# Altium schematic sheet 10_USB_Ethernet.SchDoc: USB Ethernet
size A3; Organization: Lime Microsystems; Address1: Surrey Tech Centre; Address2: Guildford GU2 7YG; Address3: Surrey; Address4: United Kingdom; Revision: v2.0; SheetNumber: 10; SheetTotal: 15
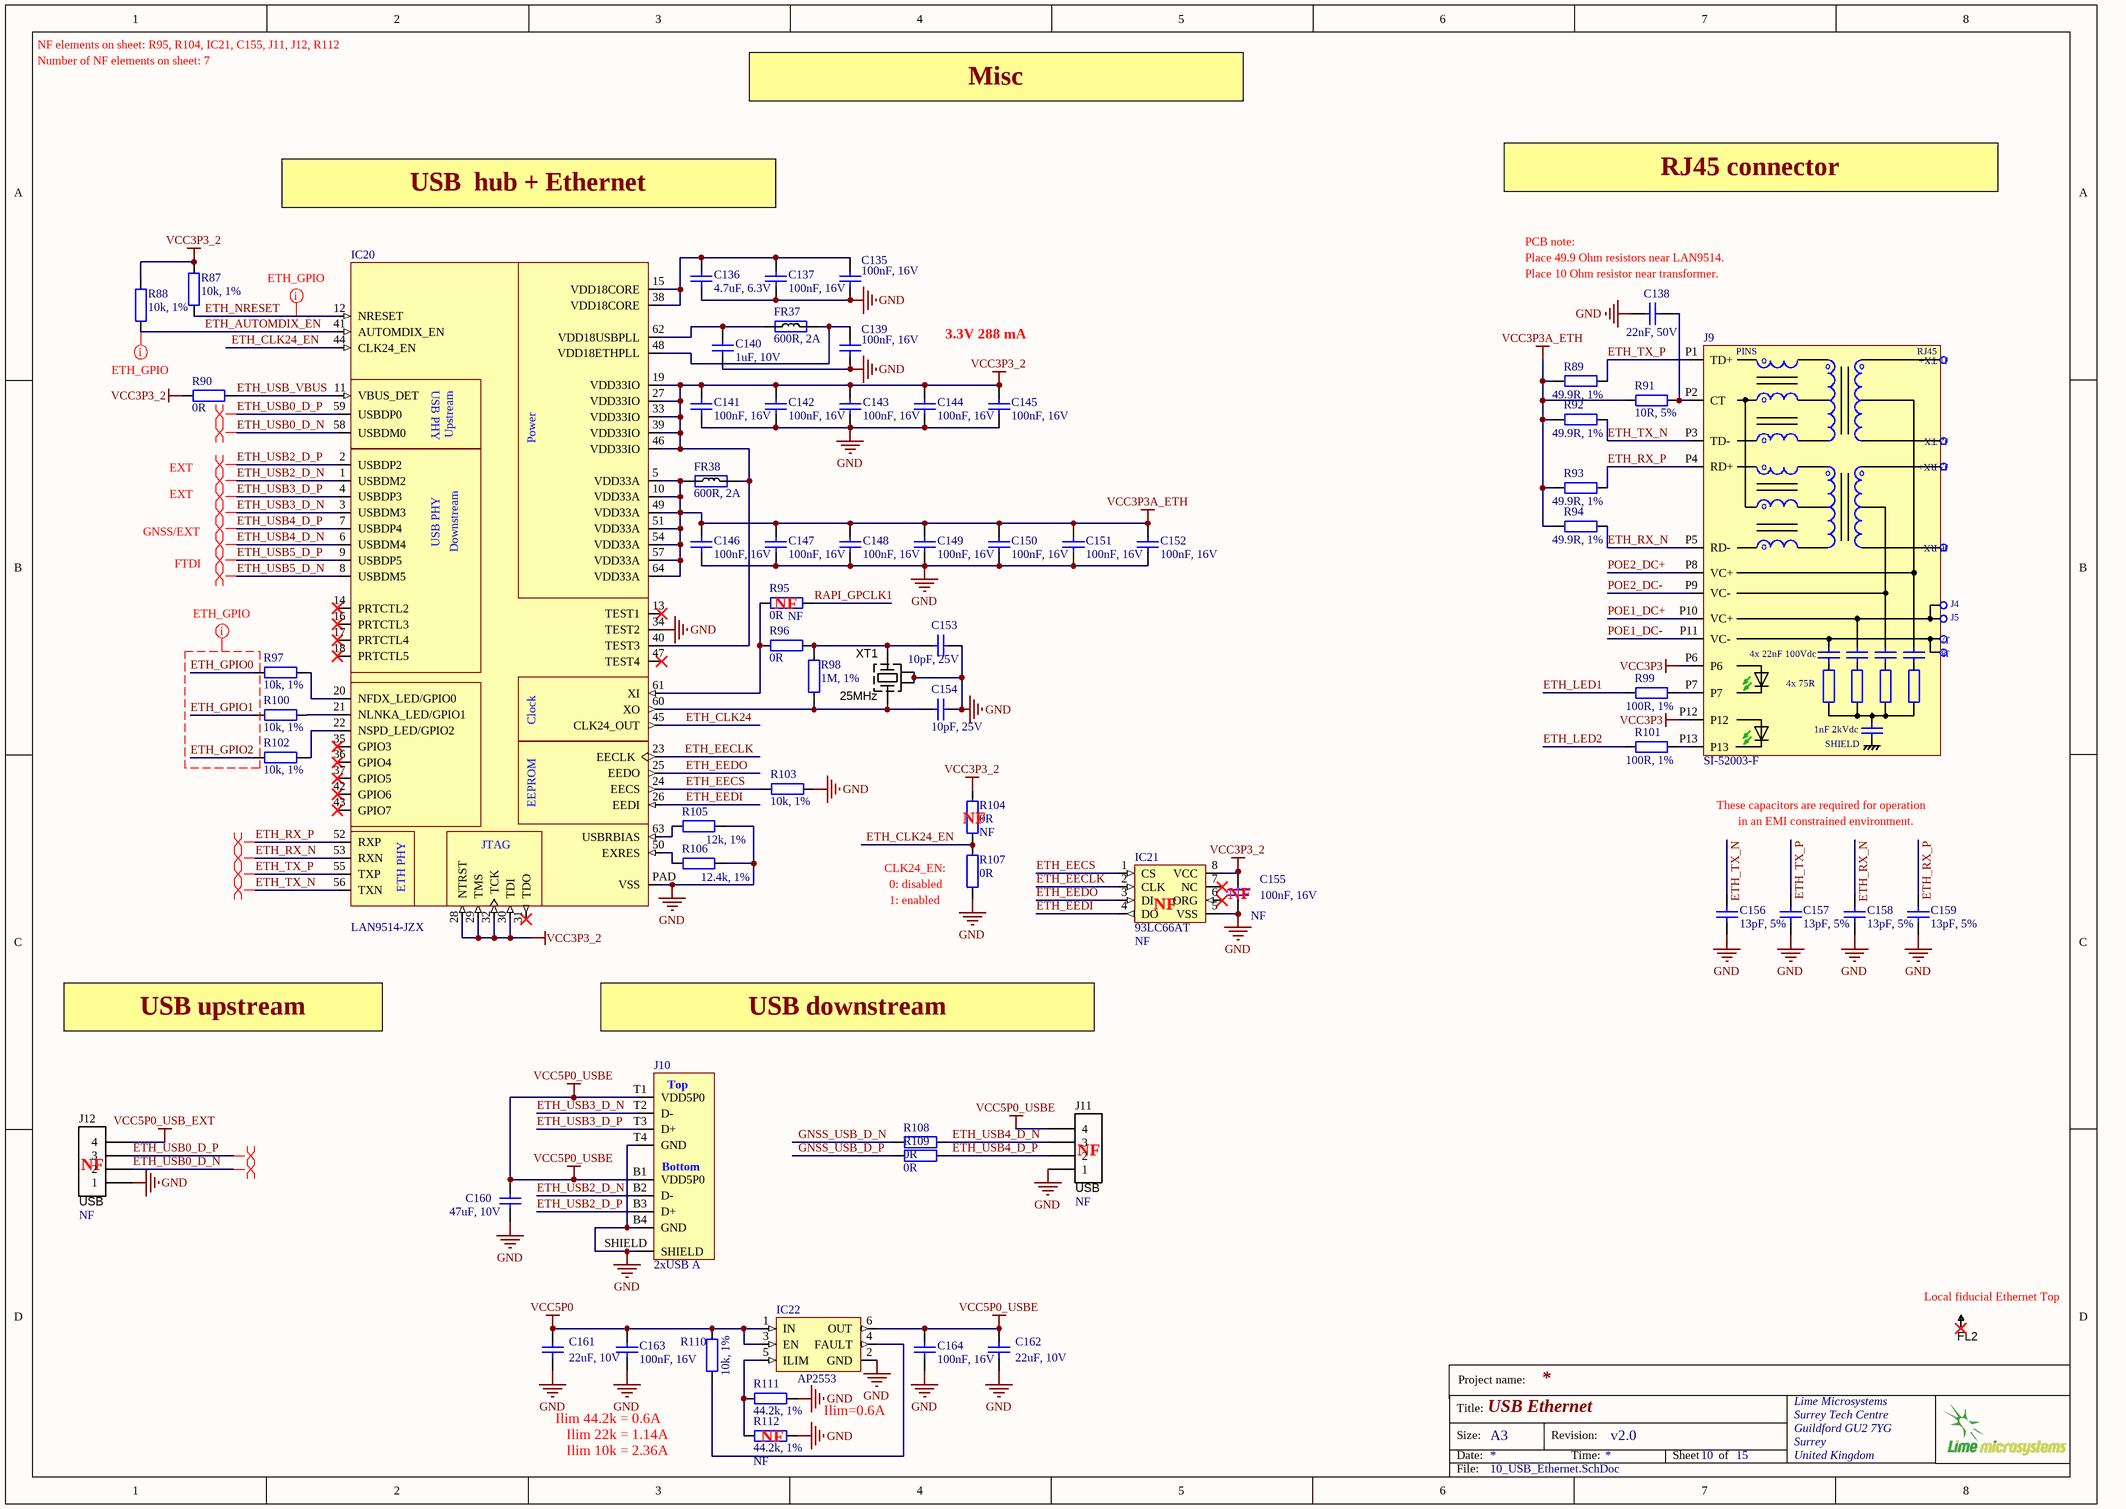
[diagram p0: 10_USB_Ethernet.SchDoc]

## Parts
C135  100nF, 16V  [CAP0402]
C136  4.7uF, 6.3V  [CAP0402]
C137  100nF, 16V  [CAP0402]
C138  22nF, 50V  [CAP0402]
C139  100nF, 16V  [CAP0402]
C140  1uF, 10V  [CAP0402]
C141  100nF, 16V  [CAP0402]
C142  100nF, 16V  [CAP0402]
C143  100nF, 16V  [CAP0402]
C144  100nF, 16V  [CAP0402]
C145  100nF, 16V  [CAP0402]
C146  100nF, 16V  [CAP0402]
C147  100nF, 16V  [CAP0402]
C148  100nF, 16V  [CAP0402]
C149  100nF, 16V  [CAP0402]
C150  100nF, 16V  [CAP0402]
C151  100nF, 16V  [CAP0402]
C152  100nF, 16V  [CAP0402]
C153  10pF, 25V  [CAP0402]
C154  10pF, 25V  [CAP0402]
C155  100nF, 16V  Assembly Info: NF  [CAP0402]
C156  13pF, 5%  [CAP0402]
C157  13pF, 5%  [CAP0402]
C158  13pF, 5%  [CAP0402]
C159  13pF, 5%  [CAP0402]
C160  47uF, 10V  [CAP1206]
C161  22uF, 10V  [CAP0603]
C162  22uF, 10V  [CAP0603]
C163  100nF, 16V  [CAP0402]
C164  100nF, 16V  [CAP0402]
FL2  Fiducial  [Fiducial_local]  (value not drawn)
FR37  600R, 2A  [RES0805]
FR38  600R, 2A  [RES0805]
IC20  LAN9514-JZX  [LAN9514I-JZX_QFN50P900X900X100-65N]
IC21  93LC66AT  Assembly Info: NF  [SOIC127P600-8DL_v2]
IC22  AP2553  [SOT23-6]
J9  SI-52003-F  [RJ45_SI-52003-F]
J10  2xUSB A  [USB_typeA_double_USBR-A-D-F-O-TH]
J11  USB  Assembly Info: NF  [HEADER4X1_TH]
J12  USB  Assembly Info: NF  [HEADER4X1_TH]
R87  10k, 1%  [RES0402]
R88  10k, 1%  [RES0402]
R89  49.9R, 1%  [RES0402]
R90  0R  [RES0402]
R91  10R, 5%  [RES0402]
R92  49.9R, 1%  [RES0402]
R93  49.9R, 1%  [RES0402]
R94  49.9R, 1%  [RES0402]
R95  0R  Assembly Info: NF  [RES0402]
R96  0R  [RES0402]
R97  10k, 1%  [RES0402]
R98  1M, 1%  [RES0402]
R99  100R, 1%  [RES0402]
R100  10k, 1%  [RES0402]
R101  100R, 1%  [RES0402]
R102  10k, 1%  [RES0402]
R103  10k, 1%  [RES0402]
R104  0R  Assembly Info: NF  [RES0402]
R105  12k, 1%  [RES0402]
R106  12.4k, 1%  [RES0402]
R107  0R  [RES0402]
R108  0R  [RES0402]
R109  0R  [RES0402]
R110  10k, 1%  [RES0402]
R111  44.2k, 1%  [RES0402]
R112  44.2k, 1%  Assembly Info: NF  [RES0402]
XT1  25MHz  [CRYSTAL_4-LCC]

## Nets
GND: C135.2 C136.1 C137.2 C138.1 C139.2 C140.1 C141.2 C142.2 C143.2 C144.2 C145.2 C146.2 C147.2 C148.2 C149.2 C150.2 C151.2 C152.2 C153.1 C154.1 C155.2 C156.2 C157.2 C158.2 C159.2 C160.1 C161.1 C162.1 C163.2 C164.2 IC20.34(TEST2) IC20.PAD(VSS) IC21.5(VSS) IC22.2(GND) J10.B4(GND) J10.SHIELD J10.T4(GND) J11.1 J12.1 R103.1 R105.2 R106.2 R107.2 R111.2 R112.2 XT1.2(GND) XT1.4(GND)
VCC3P3: J9.P6 J9.P12
VCC3P3_2: C141.1 C142.1 C143.1 C144.1 C145.1 C155.1 FR38.2 IC20.19(VDD33IO) IC20.27(VDD33IO) IC20.28(NTRST) IC20.29(TMS) IC20.30(TDI) IC20.32(TCK) IC20.33(VDD33IO) IC20.39(VDD33IO) IC20.40(TEST3) IC20.46(VDD33IO) IC21.8(VCC) R87.2 R88.2 R90.1 R104.1
VCC3P3A_ETH: C146.1 C147.1 C148.1 C149.1 C150.1 C151.1 C152.1 FR38.1 IC20.5(VDD33A) IC20.10(VDD33A) IC20.49(VDD33A) IC20.51(VDD33A) IC20.54(VDD33A) IC20.57(VDD33A) IC20.64(VDD33A) R89.2 R91.1 R92.2 R93.2 R94.2
VCC5P0: C161.2 C163.1 IC22.1(IN) IC22.3(EN) R110.1
VCC5P0_USB_EXT: J12.4
VCC5P0_USBE: C160.2 C162.2 C164.1 IC22.6(OUT) J10.B1(VDD5P0) J10.T1(VDD5P0) J11.4
ETH_AUTOMDIX_EN: IC20.41(AUTOMDIX_EN) R88.1
ETH_CLK24: IC20.45(CLK24_OUT)
ETH_CLK24_EN: IC20.44(CLK24_EN) R104.2 R107.1
ETH_EECLK: IC20.23(EECLK) IC21.2(CLK)
ETH_EECS: IC20.24(EECS) IC21.1(CS) R103.2
ETH_EEDI: IC20.26(EEDI) IC21.4(DO)
ETH_EEDO: IC20.25(EEDO) IC21.3(DI)
ETH_GPIO0: R97.2
ETH_GPIO1: R100.2
ETH_GPIO2: R102.2
ETH_LED1: R99.1
ETH_LED2: R101.1
ETH_NRESET: IC20.12(NRESET) R87.1
ETH_RX_N: C158.1 IC20.53(RXN) J9.P5(RD-) R94.1
ETH_RX_P: C159.1 IC20.52(RXP) J9.P4(RD+) R93.1
ETH_TX_N: C156.1 IC20.56(TXN) J9.P3(TD-) R92.1
ETH_TX_P: C157.1 IC20.55(TXP) J9.P1(TD+) R89.1
ETH_USB0_D_N: IC20.58(USBDM0) J12.2
ETH_USB0_D_P: IC20.59(USBDP0) J12.3
ETH_USB2_D_N: IC20.1(USBDM2) J10.B2(D-)
ETH_USB2_D_P: IC20.2(USBDP2) J10.B3(D+)
ETH_USB3_D_N: IC20.3(USBDM3) J10.T2(D-)
ETH_USB3_D_P: IC20.4(USBDP3) J10.T3(D+)
ETH_USB4_D_N: IC20.6(USBDM4) J11.3 R108.1
ETH_USB4_D_P: IC20.7(USBDP4) J11.2 R109.1
ETH_USB5_D_N: IC20.8(USBDM5)
ETH_USB5_D_P: IC20.9(USBDP5)
ETH_USB_VBUS: IC20.11(VBUS_DET) R90.2
GNSS_USB_D_N: R108.2
GNSS_USB_D_P: R109.2
POE1_DC+: J9.P10(VC+)
POE1_DC-: J9.P11(VC-)
POE2_DC+: J9.P8(VC+)
POE2_DC-: J9.P9(VC-)
RAPI_GPCLK1: R95.2
NetC135_1: C135.1 C136.2 C137.1 IC20.15(VDD18CORE) IC20.38(VDD18CORE)
NetC138_2: C138.2 J9.P2(CT) R91.2
NetC139_1: C139.1 FR37.2 IC20.48(VDD18ETHPLL)
NetC140_2: C140.2 FR37.1 IC20.62(VDD18USBPLL)
NetC153_2: C153.2 R96.2 R98.1 XT1.1(X)
NetC154_2: C154.2 IC20.60(XO) R98.2 XT1.3(X)
NetIC20_20: IC20.20(NFDX_LED/GPIO0) R97.1
NetIC20_21: IC20.21(NLNKA_LED/GPIO1) R100.1
NetIC20_22: IC20.22(NSPD_LED/GPIO2) R102.1
NetIC20_50: IC20.50(EXRES) R106.1
NetIC20_61: IC20.61(XI) R95.1 R96.1
NetIC20_63: IC20.63(USBRBIAS) R105.1
NetIC22_4: IC22.4(FAULT) R110.2
NetIC22_5: IC22.5(ILIM) R111.1 R112.1
NetJ9_P7: J9.P7 R99.2
NetJ9_P13: J9.P13 R101.2

Not connected (* = marked no-connect by the designer): FL2 1*; IC20 13(TEST1)* 14(PRTCTL2)* 16(PRTCTL3)* 17(PRTCTL4)* 18(PRTCTL5)* 31(TDO)* 35(GPIO3)* 36(GPIO4)* 37(GPIO5)* 42(GPIO6)* 43(GPIO7)* 47(TEST4)*; IC21 6(ORG)* 7(NC)*

## Layout directives
differential pair: ETH_RX_N, ETH_RX_P, ETH_TX_N, ETH_TX_P, ETH_USB0_D_N, ETH_USB0_D_P, ETH_USB2_D_N, ETH_USB2_D_P, ETH_USB3_D_N, ETH_USB3_D_P, ETH_USB4_D_N, ETH_USB4_D_P, ETH_USB5_D_N, ETH_USB5_D_P
net class ETH_GPIO: ETH_AUTOMDIX_EN, ETH_GPIO0, ETH_GPIO1, ETH_GPIO2, ETH_NRESET

## Notes on the sheet
- NF elements on sheet: R95, R104, IC21, C155, J11, J12, R112
- Number of NF elements on sheet: 7
- Misc
- USB  hub + Ethernet
- RJ45 connector
- PCB note:
- (near C138) Place 49.9 Ohm resistors near LAN9514.
- (near C138) Place 10 Ohm resistor near transformer.
- 3.3V 288 mA
- EXT
- GNSS/EXT
- FTDI
- (near R95) NF
- (near R104) NF
- These capacitors are required for operation
- in an EMI constrained environment.
- CLK24_EN:
- (near R107) 0: disabled
- (near R107) 1: enabled
- (near IC21) NF
- (near C155) NF
- USB upstream
- USB downstream
- (near J12) NF
- (near J11) NF
- (near FL2) Local fiducial Ethernet Top
- Ilim 44.2k = 0.6A
- Ilim 22k = 1.14A
- Ilim 10k = 2.36A
- (near R112) NF
- Ilim=0.6A
- Project name:
- Title:
- Size:
- Date:
- A3
- Revision:
- Time:
- Sheet
- of
- File:
- (in symbol LAN9514-JZX-TR) USB PHY; Upstream; Power; Downstream; Clock; EEPROM; JTAG; ETH PHY
- (in symbol RJ45_SI-52003-F) PINS; J1 TX+; J2 TX-; J3 RX+; J6 RX-; J4; J5; J7; J8; 4x 22nF 100Vdc; 4x 75R; 1nF 2kVdc; SHIELD
- (in symbol USB_typeA_double_USBR-A-D-F-O-TH) Top; Bottom

## Library data of the parts
C135 C137 C139 C141-C152 C155 C163 C164 = Cap_0402: Manufacturer: Murata Electronics; Manufacturer Part Number: GRM155R71C104KA88D; Part Description: CAP CER 0.1UF 16V X7R 0402; Tolerance: 10 %; Type: General Purpose MLCC; Capacitance: 0.1 uF; Case Length: 1 mm; Dielectric: X7R; Case Height: 0.5 mm; Temperature Coefficient / Code: +/- 15 %; Value: 100nF, 16V; Supplier 1: Mouser; Supplier Part Number 1: 81-GRM155R71C104KA88; Case Code - in: 0402; RoHS: RoHS Compliant; Operating Temperature Range: - 55 C to + 125 C; Series: GRM; Termination Style: SMD/SMT; Package / Case: 0402 (1005 metric); Voltage Rating DC: 16 V; Maximum Operating Temperature: + 125 C; Case Code - mm: 1005; Minimum Operating Temperature: - 55 C; Product Category: Low & Medium Capacitance SMD Ceramic Chip Capacitors; Packaging: Reel; Product: General Type MLCCs; Category: Multilayer Ceramic Capacitors MLCC - SMD/SMT; Brand: Murata Electronics; Case Width: 0.5 mm; RoHS - Mouser: Y; Standard Pack Qty: 10000; Minimum Order Quantity: 1; Reeling: True; Manufacturer Part Number 1: GRM155R71C104KA88D
C136 = Cap_0402: Manufacturer: Murata Electronics North America; Manufacturer Part Number: GRM155R60J475ME87D; Part Description: 4.7µF ±20% 6.3V X5R Ceramic Capacitor -55°C ~ 85°C Surface Mount, MLCC 0402 (1005 Metric) 0.039" L x 0.020" W (1.00mm x 0.50mm); Tolerance: ±20%; Capacitance: 4.7µF; Temperature Coefficient: X5R; Lead Style: -; Ratings: -; Height - Seated (Max): -; Thickness (Max): 0.022" (0.55mm); Voltage - Rated: 6.3V; Packaging: Cut Tape (CT); Lead Spacing: -; Category: Capacitors; Supplier Part Number 1: 490-5408-1-ND; Applications: General Purpose; Operating Temperature: -55°C ~ 85°C; Mounting Type: Surface Mount, MLCC; Features: Derating Recommended; RoHS: RoHS Compliant; Supplier 1: Digi-Key; Package / Case: 0402 (1005 Metric); Size / Dimension: 0.039" L x 0.020" W (1.00mm x 0.50mm); Value: 4.7uF, 6.3V
C138 = Cap_0402: Manufacturer: Kemet; Manufacturer Part Number 1: C0402C223K5RACTU; Part Description: 0.022µF ±10% 50V Ceramic Capacitor X7R 0402 (1005 Metric); Temperature Coefficient: X7R; Tolerance: ±10%; Capacitance: 0.022µF; Value: 22nF, 50V; Supplier 1: Digi-Key; Supplier Part Number 1: 399-7780-1-ND; Ratings: -; Packaging: Cut Tape (CT); Category: Capacitors; Size / Dimension: 0.039" L x 0.020" W (1.00mm x 0.50mm); RoHS: RoHS Compliant; Operating Temperature: -55°C ~ 125°C; Mounting Type: Surface Mount, MLCC; Applications: General Purpose; Voltage - Rated: 50V; Thickness (Max): 0.022" (0.55mm); Features: -; Height - Seated (Max): -; Lead Style: -; Package / Case: 0402 (1005 Metric); Lead Spacing: -
C140 = Cap_0402: CAP CER 1UF 10V X5R 0402; Manufacturer: Yageo; Part Description: 1µF 10V Ceramic Capacitor X5R 0402 (1005 Metric) 0.039" L x 0.020" W (1.00mm x 0.50mm); Manufacturer Part Number: CC0402MRX5R6BB105; Notification: Current market demand for these product types have resulted in fluctuating and extending lead times. Lead times may differ.; Tolerance: ±20%; Value: 1uF, 10V; Supplier 1: Digi-Key; Supplier Part Number 1: 311-1732-1-ND; RoHS: RoHS Compliant; Applications: General Purpose; Category: Capacitors; ComponentLink1Description: http://www.yageo.com/documents/recent/UPY-GPHC_X5R_4V-to-50V_25.pdf; ComponentLink1URL: http://www.yageo.com/documents/recent/UPY-GPHC_X5R_4V-to-50V_25.pdf; Failure Rate: -; Features: -; Height - Seated (Max): -; Lead Spacing: -; Lead Style: -; Mounting Type: Surface Mount, MLCC; Operating Temperature: -55°C ~ 85°C; Package / Case: 0402 (1005 Metric); Packaging: Cut Tape (CT); Part Status: Active; Pricing 1: 1=0.22, 10=0.156, 100=0.0732, 500=0.0513, 1000=0.04248, 2500=0.03953, 5000=0.03617 (USD); Ratings: -; Size / Dimension: 0.039" L x 0.020" W (1.00mm x 0.50mm); Stock 1: 69600; Temperature Coefficient: X5R; Thickness (Max): 0.022" (0.55mm); Voltage - Rated: 10V
C153 C154 = Cap_0402: Manufacturer: AVX; Part Description: 10pF ±5% 25V C0G, NP0 Ceramic Capacitor -55°C ~ 125°C Surface Mount, MLCC 0402 (1005 Metric) 0.039" L x 0.020" W (1.00mm x 0.50mm); Manufacturer Part Number 1: 04023A100JAT2A; Capacitance: 10; Ceramic Capacitor Case: 0402 [1005 Metric]; Capacitance Tolerance: ± 5%; Capacitor Case Style: 0402 [1005 Metric]<!--FANDB--><div class="features-and-benefits-container"></div>; Dielectric Characteristic: C0G / NP0; SVHC: No SVHC (16-Jun-2014); Voltage Rating: 25; Supplier 1: Farnell; Supplier Part Number 1: 2332478RL; value: 10pF, 25V; Capacitance Tolerance ±: ± 5%; MSL: MSL 1 - Unlimited; Operating Temperature Max: 125; Operating Temperature Min: -55; Packaging: Cut Tape; Product Range: -; RoHS: YES
C156-C159 = Cap_0603: Manufacturer: Murata Electronics North America; Part Description: 13pF ±5% 50V C0G, NP0 Ceramic Capacitor -55°C ~ 125°C Surface Mount, MLCC 0402 (1005 Metric) 0.039" L x 0.020" W (1.00mm x 0.50mm); Voltage - Rated: 50V; Supplier 1: Digi-Key; Supplier Part Number 1: 490-5925-2-ND; Tolerance: ±5%; Capacitance: 13pF; Category: Capacitors; Package / Case: 0402 (1005 Metric); Value: 13pF, 5%
C160 = Cap_1206: Manufacturer: TDK Corporation; Manufacturer Part Number 1: C3216X6S1A476M160AC; Part Description: 47µF ±20% 10V Ceramic Capacitor X6S 1206 (3216 Metric); Notification: Current market demand for these product types have resulted in fluctuating and extending lead times. Lead times may differ.; Tolerance: ±20%; Temperature Coefficient: X6S; Value: 47uF, 10V; RoHS: RoHS Compliant; Packaging: Cut Tape (CT); Operating Temperature: -55°C ~ 105°C; Voltage - Rated: 10V; Height - Seated (Max): -; Ratings: -; Applications: General Purpose; Features: Low ESL; Size / Dimension: 0.126" L x 0.063" W (3.20mm x 1.60mm); Supplier 1: Digi-Key; Lead Spacing: -; Supplier Part Number 1: 445-6010-1-ND; Thickness (Max): 0.071" (1.80mm); Failure Rate: -; Category: Capacitors; Lead Style: -; Part Status: Active; Mounting Type: Surface Mount, MLCC; Package / Case: 1206 (3216 Metric)
C161 C162 = Cap_0603: Manufacturer Part Number 1: C1608X5R1A226M080AC; Manufacturer: TDK Corporation; Part Description: 22µF ±20% 10V X5R Ceramic Capacitor -55°C ~ 85°C Surface Mount, MLCC 0603 (1608 Metric) 0.063" L x 0.031" W (1.60mm x 0.80mm); Brand: TDK; Temperature Coefficient / Code: +/- 15 %; Tolerance: 20 %; Type: Multilayer Ceramic Chip Capacitor; Supplier 1: Mouser; Supplier Part Number 1: 810-C1608X5R1A226M; Package / Case: 0603 (1608 metric); Category: Multilayer Ceramic Capacitors MLCC - SMD/SMT; Capacitance: 22 uF; Operating Temperature Range: - 55 C to + 85 C; Case Code - in: 0603; Voltage Rating DC: 10 V; Case Code - mm: 1608; Value: 22uF, 10V
FR37 FR38 = Ferrite: Manufacturer Part Number 1: MPZ2012S601AT000; Manufacturer: TDK Corporation; Part Description: FERRITE BEAD 600 OHM 0805 1LN; Filter Type: Differential Mode - Single; Impedance @ Frequency: 600 Ohm @ 100MHz; DC Resistance (DCR): 100 mOhm Max; Supplier 1: Digi-Key; Supplier Part Number 1: 445-2206-2-ND; Mounting Type: Surface Mount; RoHS: RoHS Compliant; Height (Max): 0.041" (1.05mm); Packaging: Tape & Reel (TR); Category: Filters; Current Rating: 2A; Package / Case: 0805 (2012 Metric); Size / Dimension: 0.079" L x 0.049" W (2.00mm x 1.25mm); Value: 600R, 2A
IC20 = LAN9514-JZX-TR: Part Description: Ethernet Bridge, USB to Ethernet USB 2.0, 10/100 Base-T/TX PHY USB Interface 64-QFN (9x9; Manufacturer: Microchip Technology; Protocol: Ethernet; Function: Bridge, USB to Ethernet; Interface: USB; Standards: USB 2.0, 10/100 Base-T/TX PHY; Voltage - Supply: 1.8V, 3.3V; Current - Supply: 288mA; Supplier 1: Digi-Key; Manufacturer Part Number 1: LAN9514-JZX-TR; RoHS: RoHS Compliant; Category: Integrated Circuits (ICs); Stock 1: 3000; Pricing 1: 1=5.84, 25=4.8616, 100=4.8363 (USD); Packaging: Digi-Reel®; Part Status: Active; Operating Temperature: 0°C ~ 70°C; Package / Case: 64-VFQFN Exposed Pad; Supplier Device Package: 64-QFN (9x9); Base Part Number: LAN9514; ComponentLink1URL: http://www.microchip.com/mymicrochip/filehandler.aspx?ddocname=en562340; ComponentLink1Description: http://www.microchip.com/mymicrochip/filehandler.aspx?ddocname=en562340; Supplier Part Number 1: LAN9514-JZX-DKR-ND
IC21 = 93LC66AT-I/SN_EEPROM: Part Description: EEPROM Memory IC 4Kb (512 x 8) SPI 2MHz 8-SOIC; Manufacturer: Microchip Technology; Memory Type: Non-Volatile; Memory Format: EEPROM; Memory Size: 4Kb (512 x 8); Write Cycle Time - Word, Page: 6ms; Memory Interface: SPI; Voltage - Supply: 2.5 V ~ 5.5 V; Supplier 1: Digi-Key; Manufacturer Part Number 1: 93LC66AT-I/SN; RoHS: RoHS Compliant; Category: Integrated Circuits (ICs); Stock 1: 6857; Pricing 1: 1=0.27, 25=0.2576, 100=0.2543 (USD); Packaging: Digi-Reel®; Part Status: Active; Technology: EEPROM; Operating Temperature: -40°C ~ 85°C (TA); Mounting Type: Surface Mount; Package / Case: 8-SOIC (0.154", 3.90mm Width); Supplier Device Package: 8-SOIC; ComponentLink1URL: http://www.microchip.com/mymicrochip/filehandler.aspx?ddocname=en011819; ComponentLink1Description: http://www.microchip.com/mymicrochip/filehandler.aspx?ddocname=en011819; Supplier Part Number 1: 93LC66AT-I/SNDKR-ND
IC22 = AP2553W6-7: Manufacturer: Diodes; Part Description: IC PD SW CURR LIMIT SOT26; Number of Outputs: 1; Min Supply Voltage: 2.7V; Max Supply Voltage: 5.5V; Interface: On/Off; Max Output Current: 2.1A; Turn-Off Delay Time: 500us; On-State Resistance: 70mR; Turn-On Delay Time: 1.5ms; Power Rating: 340mW; Fault Protection: Over Temperature,Reverse Current; Output Configuration: High Side; Supplier 1: Digi-Key; Manufacturer Part Number 1: AP2553W6-7; Stock 1: 53805; Pricing 1: 1=0.5, 10=0.425, 100=0.3172, 500=0.24926, 1000=0.19261 (USD); Mount: Surface Mount; Case/Package: SOT-26; Number of Pins: 6; Min Operating Temperature: -40°C; Max Operating Temperature: 85°C; Package Quantity: 3000; Packaging: Tape and Reel; Voltage: 5.5V; Current: 2.1A; Length: 3.1mm; Height: 1.3mm; Width: 1.7mm; Radiation Hardening: No; Lead Free: Lead Free; REACH SVHC: No SVHC; Supplier Part Number 1: AP2553W6-7DIDKR-ND
J9 = RJ45_SI-52003-F: Part Description: 1 Port RJ45 Magjack Connector Through Hole 10/100 Base-T, AutoMDIX, Power over Ethernet (PoE); Manufacturer: Stewart Connector; Connector Type: RJ45; LED Color: Green - Green; Number of Cores per Jack: 4; Shielding: Shielded, EMI Finger; Tab Direction: Up; Shield Material: Copper Alloy; Supplier 1: Digi-Key; Manufacturer Part Number 1: SI-52003-F; RoHS: RoHS Compliant; Category: Connectors, Interconnects; Stock 1: 11085; Pricing 1: 1=5.33, 10=5.112, 25=4.686, 50=4.473, 100=4.26, 250=3.72752, 500=3.621, 1000=3.0885, 2500=2.8755 (USD); Packaging: Tray; Part Status: Active; Applications: 10/100 Base-T, AutoMDIX, Power over Ethernet (PoE); Mounting Type: Through Hole; Orientation: 90° Angle (Right); Termination: Solder; Height Above Board: 0.550" (13.97mm); Features: Board Guide; Contact Material: Copper Alloy; Contact Finish: Gold; Operating Temperature: -; Contact Finish Thickness: 50.0µin (1.27µm); Housing Material: Thermoplastic; ComponentLink1URL: https://belfuse.com/resources/StewartConnector/SI-52003-F.pdf; ComponentLink1Description: https://belfuse.com/resources/StewartConnector/SI-52003-F.pdf; Supplier Part Number 1: 380-1119-ND
J10 = USB_typeA_double_USBR-A-D-F-O-TH: Manufacturer: Samtec; Part Description: USB - A USB 2.0 Receptacle Connector 8 Position Through Hole, Right Angle; Number of Contacts: 4; Number of Ports: 1; Max Voltage Rating (AC): 30V; Gender: Female; Supplier 1: Digi-Key; Manufacturer Part Number 1: USBR-A-D-F-O-TH; Stock 1: 2359; Pricing 1: 1=1.6, 10=1.448, 25=1.3592, 50=1.3002, 100=1.2411, 250=1.12292, 500=1.03426, 1000=0.8865, 2500=0.8274 (USD); Mount: Through Hole; Contact Material: Bronze; Contact Plating: Gold; Number of Terminals: 4; Housing Material: Thermoplastic; Min Operating Temperature: -50°C; Max Operating Temperature: 85°C; Packaging: Bulk; Termination: Solder; Orientation: Right Angle; Radiation Hardening: No; Supplier Part Number 1: SAM10376-ND
J11 J12 = Header4P: Header, 4-pin; Part Description: 4 Positions Header Connector 0.100" (2.54mm) Through Hole Gold; Manufacturer: Wurth Electronics Inc.; Manufacturer Part Number: 61300411121; Pitch - Mating: 0.100" (2.54mm); Number of Positions: 4; Number of Positions Loaded: All; Style: Board to Board or Cable; Shrouding: Unshrouded; Contact Length - Mating: 0.236" (6.00mm); Contact Length - Post: 0.118" (3.00mm); Overall Contact Length: 0.454" (11.54mm); Material Flammability Rating: UL94 V-0; Current Rating: 3A; Voltage Rating: 250V; Supplier 1: Digi-Key; Supplier Part Number 1: 732-5317-ND; RoHS: RoHS Compliant; Category: Connectors, Interconnects; Stock 1: 25204; Pricing 1: 1=0.18, 10=0.153, 25=0.1272, 50=0.106, 100=0.096, 1000=0.088 (USD); Packaging: Bulk; Part Status: Active; Connector Type: Header; Contact Type: Male Pin; Number of Rows: 1; Row Spacing - Mating: -; Mounting Type: Through Hole; Termination: Solder; Fastening Type: Push-Pull; Insulation Height: 0.100" (2.54mm); Contact Shape: Square; Contact Finish - Mating: Gold; Contact Finish Thickness - Mating: -; Contact Finish - Post: -; Contact Material: Copper Alloy; Insulation Material: Polybutylene Terephthalate (PBT); Features: -; Operating Temperature: -40°C ~ 125°C; Ingress Protection: -; Insulation Color: Black; Mated Stacking Heights: -; Contact Finish Thickness - Post: -; Applications: -; ComponentLink1URL: http://katalog.we-online.de/em/datasheet/6130xx11121.pdf; ComponentLink1Description: http://katalog.we-online.de/em/datasheet/6130xx11121.pdf
R87 R88 R97 R100 R102 R103 R110 = Res_0402: Manufacturer: Yageo; Manufacturer Part Number 1: RC0402FR-0710KL; Part Description: RES SMD 10K OHM 1% 1/16W 0402; Temperature Coefficient: ±100ppm/°C; Power (Watts): 0.063W, 1/16W; Value: 10k, 1%; Supplier 1: Digi-Key; Supplier Part Number 1: 311-10.0KLRTR-ND; Resistance (Ohms): 10k; Packaging: Tape & Reel (TR); RoHS: RoHS Compliant; Package / Case: 0402 (1005 Metric); Tolerance: ±1%; Operating Temperature: -55°C ~ 155°C; Size / Dimension: 0.039" L x 0.020" W (1.00mm x 0.50mm); Number of Terminations: 2; Category: Resistors; Height: 0.016" (0.40mm); Supplier Device Package: 0402; Features: Moisture Resistant; Composition: Thick Film
R89 R92-R94 = Res_0402: Manufacturer: Samsung Electro-Mechanics America, Inc.; Manufacturer Part Number: RC1005F49R9CS; Part Description: RES SMD 49.9 OHM 1% 1/16W 0402; Temperature Coefficient: ±100ppm/°C; Resistance (Ohms): 49.9; Power (Watts): 0.063W, 1/16W; Number of Terminations: 2; Size / Dimension: 0.039" L x 0.020" W (1.00mm x 0.50mm); Supplier Device Package: 0402 (1005 Metric); RoHS: RoHS Compliant; Supplier Part Number 1: 1276-3469-6-ND; Features: -; Packaging: Digi-Reel®; Tolerance: ±1%; Height: 0.016" (0.40mm); Category: Resistors; Composition: Thick Film; Package / Case: 0402 (1005 Metric); Supplier 1: Digi-Key; Operating Temperature: -55°C ~ 155°C; Value: 49.9R, 1%
R90 R95 R104 R107 = Res_0402: Manufacturer Part Number 1: RC0402JR-070RL; Manufacturer: Yageo; Part Description: RES SMD 0.0OHM JUMPER 1/16W 0402; Resistance (Ohms): 0.0; Tolerance: Jumper; Power (Watts): 0.063W, 1/16W; Value: 0R; Supplier 1: Digi-Key; Supplier Part Number 1: 311-0.0JRTR-ND; Category: Resistors; Temperature Coefficient: -; Features: Moisture Resistant; Supplier Device Package: 0402; Height: 0.016" (0.40mm); Package / Case: 0402 (1005 Metric); Operating Temperature: -55°C ~ 155°C; Size / Dimension: 0.039" L x 0.020" W (1.00mm x 0.50mm); Composition: Thick Film; Packaging: Tape & Reel (TR); Number of Terminations: 2; RoHS: RoHS Compliant
R91 = Res_0402: Manufacturer Part Number 1: RC0402JR-0710RL; Manufacturer: Yageo; Part Description: RES SMD 10 OHM 5% 1/16W 0402; Power (Watts): 0.063W, 1/16W; Resistance (Ohms): 10; Temperature Coefficient: ±200ppm/°C; Value: 10R, 5%; Supplier 1: Digi-Key; Supplier Part Number 1: 311-10JRTR-ND; Number of Terminations: 2; Height: 0.016" (0.40mm); RoHS: RoHS Compliant; Composition: Thick Film; Packaging: Tape & Reel (TR); Category: Resistors; Supplier Device Package: 0402; Features: Moisture Resistant; Tolerance: ±5%; Operating Temperature: -55°C ~ 155°C; Size / Dimension: 0.039" L x 0.020" W (1.00mm x 0.50mm); Package / Case: 0402 (1005 Metric)
R96 = Res_0402: Manufacturer: Yageo; Part Description: RES SMD 0.0OHM JUMPER 1/16W 0402; Manufacturer Part Number 1: RC0402JR-070RL; Supplier 1: Digi-Key; Supplier Part Number 1: 311-0.0JRTR-ND; Composition: Thick Film; Package / Case: 0402 (1005 Metric); Category: Resistors; Value: 0R
R98 = Res_0402: Manufacturer Part Number: RC0402FR-071ML; Manufacturer: Yageo; Part Description: 1 MOhms ±1% 0.063W, 1/16W Chip Resistor 0402 (1005 Metric) Moisture Resistant Thick Film; Power (Watts): 0.063W, 1/16W; Temperature Coefficient: ±100ppm/°C; Value: 1M, 1%; Package / Case: 0402 (1005 Metric); Failure Rate: -; Supplier Device Package: 0402; Tolerance: ±1%; Composition: Thick Film; Category: Resistors; Part Status: Active; Height - Seated (Max): 0.016" (0.40mm); Size / Dimension: 0.039" L x 0.020" W (1.00mm x 0.50mm); Supplier 1: Digi-Key; Operating Temperature: -55°C ~ 155°C; Supplier Part Number 1: 311-1.00MLRCT-ND; RoHS: RoHS Compliant; Features: Moisture Resistant; Packaging: Cut Tape (CT)
R99 R101 = Res_0402: Manufacturer Part Number 1: RMCF0402FT100R; Manufacturer: Stackpole Electronics Inc.; Part Description: RES SMD 100 OHM 1% 1/16W 0402; Power (Watts): 0.063W, 1/16W; Temperature Coefficient: ±100ppm/°C; Resistance (Ohms): 100; Value: 100R, 1%; Supplier 1: Digi-Key; Supplier Part Number 1: RMCF0402FT100RDKR-ND; Packaging: Digi-Reel®; Composition: Thick Film; Number of Terminations: 2; Package / Case: 0402 (1005 Metric); RoHS: RoHS Compliant; Category: Resistors; Size / Dimension: 0.039" L x 0.020" W (1.00mm x 0.50mm); Tolerance: ±1%; Supplier Device Package: 0402; Features: -; Height: 0.016" (0.40mm); Operating Temperature: -55°C ~ 155°C
R105 = Res_0402: Manufacturer: Samsung Electro-Mechanics; Manufacturer Part Number 1: RC1005F123CS; Part Description: 12 kOhms ±1% 0.063W, 1/16W Chip Resistor 0402 (1005 Metric) Moisture Resistant Thick Film; Power (Watts): 0.063W, 1/16W; Temperature Coefficient: ±100ppm/°C; Value: 12k, 1%; Operating Temperature: -55°C ~ 155°C; Height - Seated (Max): 0.016" (0.40mm); Supplier 1: Digi-Key; Packaging: Cut Tape (CT); Composition: Thick Film; Tolerance: ±1%; Category: Resistors; Part Status: Active; Failure Rate: -; Supplier Device Package: 0402; Features: Moisture Resistant; Supplier Part Number 1: 1276-4122-1-ND; RoHS: RoHS Compliant; Package / Case: 0402 (1005 Metric); Size / Dimension: 0.039" L x 0.020" W (1.00mm x 0.50mm)
R106 = Res_0402: Manufacturer Part Number 1: RT0402BRE0712K4L; Manufacturer: Yageo; Part Description: 12.4 kOhms ±0.1% 0.063W, 1/16W Chip Resistor 0402 (1005 Metric)  Thin Film; Temperature Coefficient: ±50ppm/°C; Tolerance: ±0.1%; Power (Watts): 0.063W, 1/16W; Value: 12.4k, 1%; Package / Case: 0402 (1005 Metric); RoHS: RoHS Compliant; Composition: Thin Film; Height - Seated (Max): 0.014" (0.35mm); Supplier 1: Digi-Key; Failure Rate: -; Size / Dimension: 0.039" L x 0.020" W (1.00mm x 0.50mm); Supplier Device Package: 0402; Part Status: Active; Operating Temperature: -55°C ~ 155°C; Features: -; Packaging: Cut Tape (CT); Category: Resistors; Supplier Part Number 1: YAG4337CT-ND; Part Description: RT0402BRE0712K4L; Manufacturer Part Number: RT0402BRE0712K4L
R108 R109 = Res_0402: Manufacturer: Yageo; Part Description: RES SMD 0.0OHM JUMPER 1/16W 0402; Supplier 1: Digi-Key; Supplier Part Number 1: 311-0.0JRTR-ND; Composition: Thick Film; Package / Case: 0402 (1005 Metric); Category: Resistors; Value: 0R
R111 R112 = Res_0402: Manufacturer Part Number 1: ERJ-2RKF4422X; Manufacturer: Panasonic Electronic Components; Part Description: RES SMD 44.2K OHM 1% 1/10W 0402; Power (Watts): 0.1W, 1/10W; Temperature Coefficient: ±100ppm/°C; Value: 44.2k, 1%; Supplier 1: Digi-Key; Supplier Part Number 1: P44.2KLCT-ND; Tolerance: ±1%; Supplier Device Package: 0402; Packaging: Cut Tape (CT); Size / Dimension: 0.039" L x 0.020" W (1.00mm x 0.50mm); Features: Automotive AEC-Q200; Package / Case: 0402 (1005 Metric); Height: 0.016" (0.40mm); Operating Temperature: -55°C ~ 155°C; Number of Terminations: 2; Composition: Thick Film; Resistance (Ohms): 44.2k; RoHS: RoHS Compliant; Category: Resistors
XT1 = CRYSTAL_19M2: Oscillator Crystal 25 MHz; Manufacturer Part Number 1: ABM8-25.000MHZ-B2-T; Manufacturer: ABRACON; Part Description: 25MHz ±20ppm Crystal 18pF 50 Ohm -20°C ~ 70°C Surface Mount 4-SMD, No Lead (DFN, LCC); Supplier 1: Newark; Supplier Part Number 1: 13J1767